# Altium schematic sheet analog_refs.SchDoc
size 699 x 359 mm; SheetNumber: 9; SheetTotal: 13
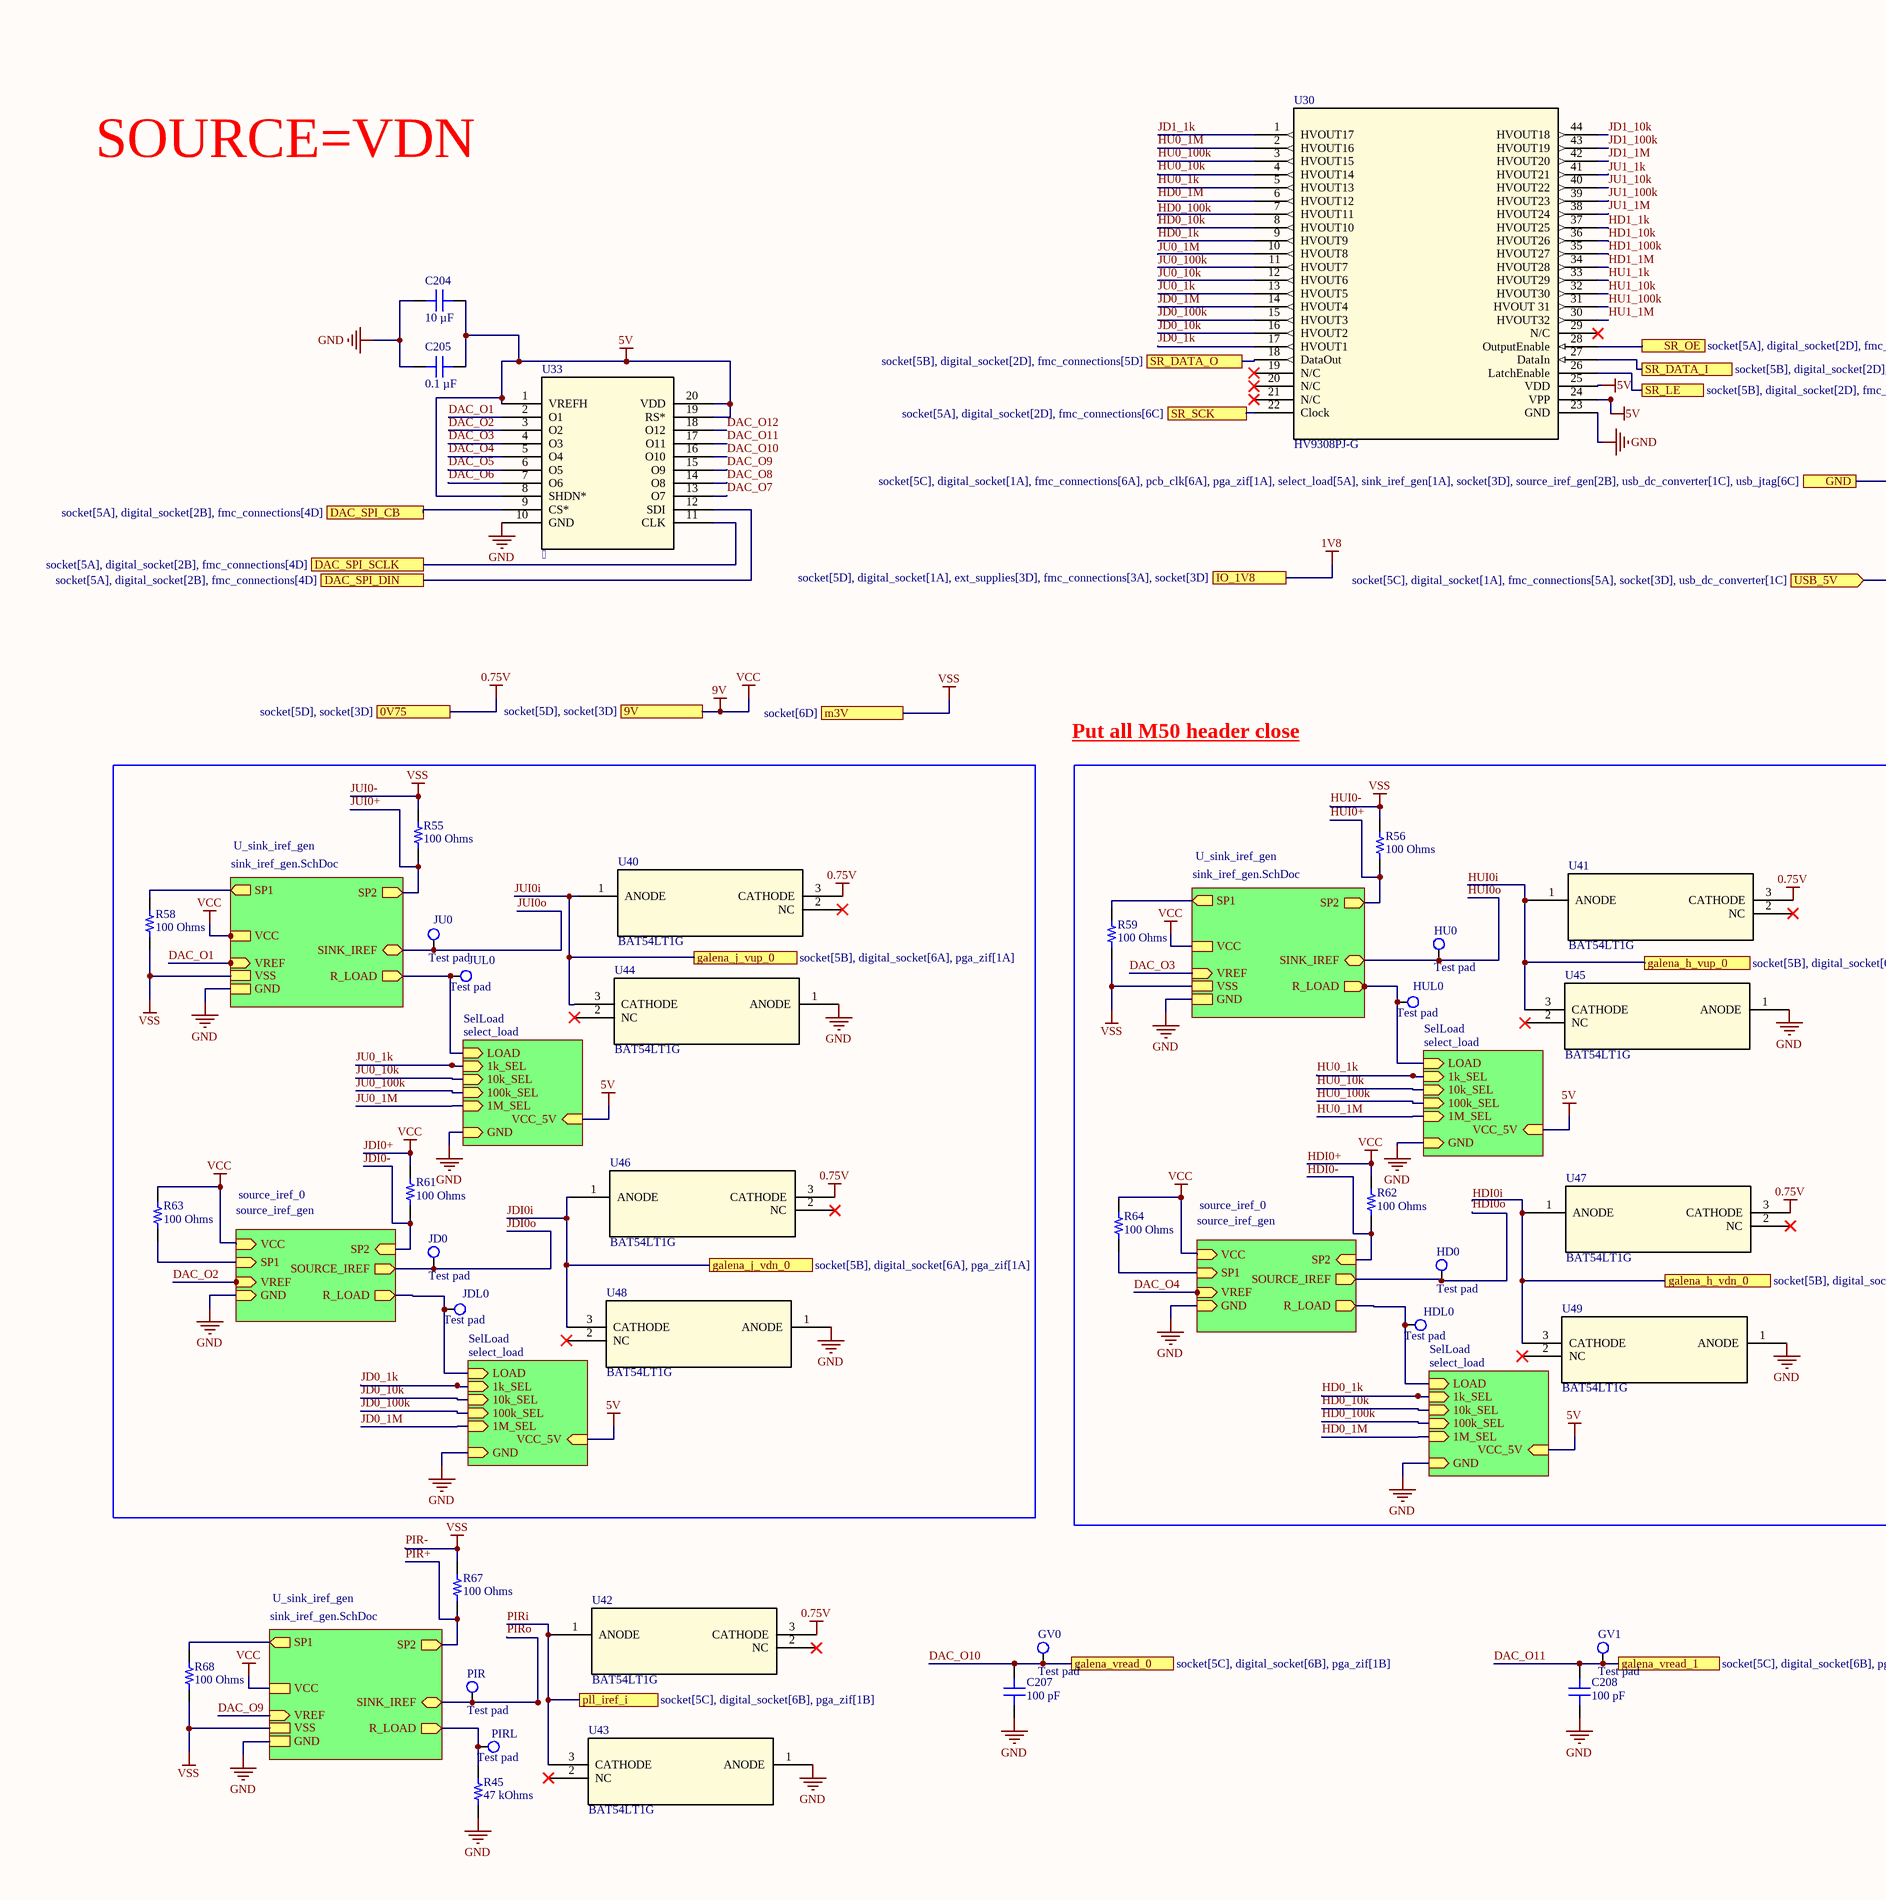
[diagram p0: analog_refs.SchDoc, left]
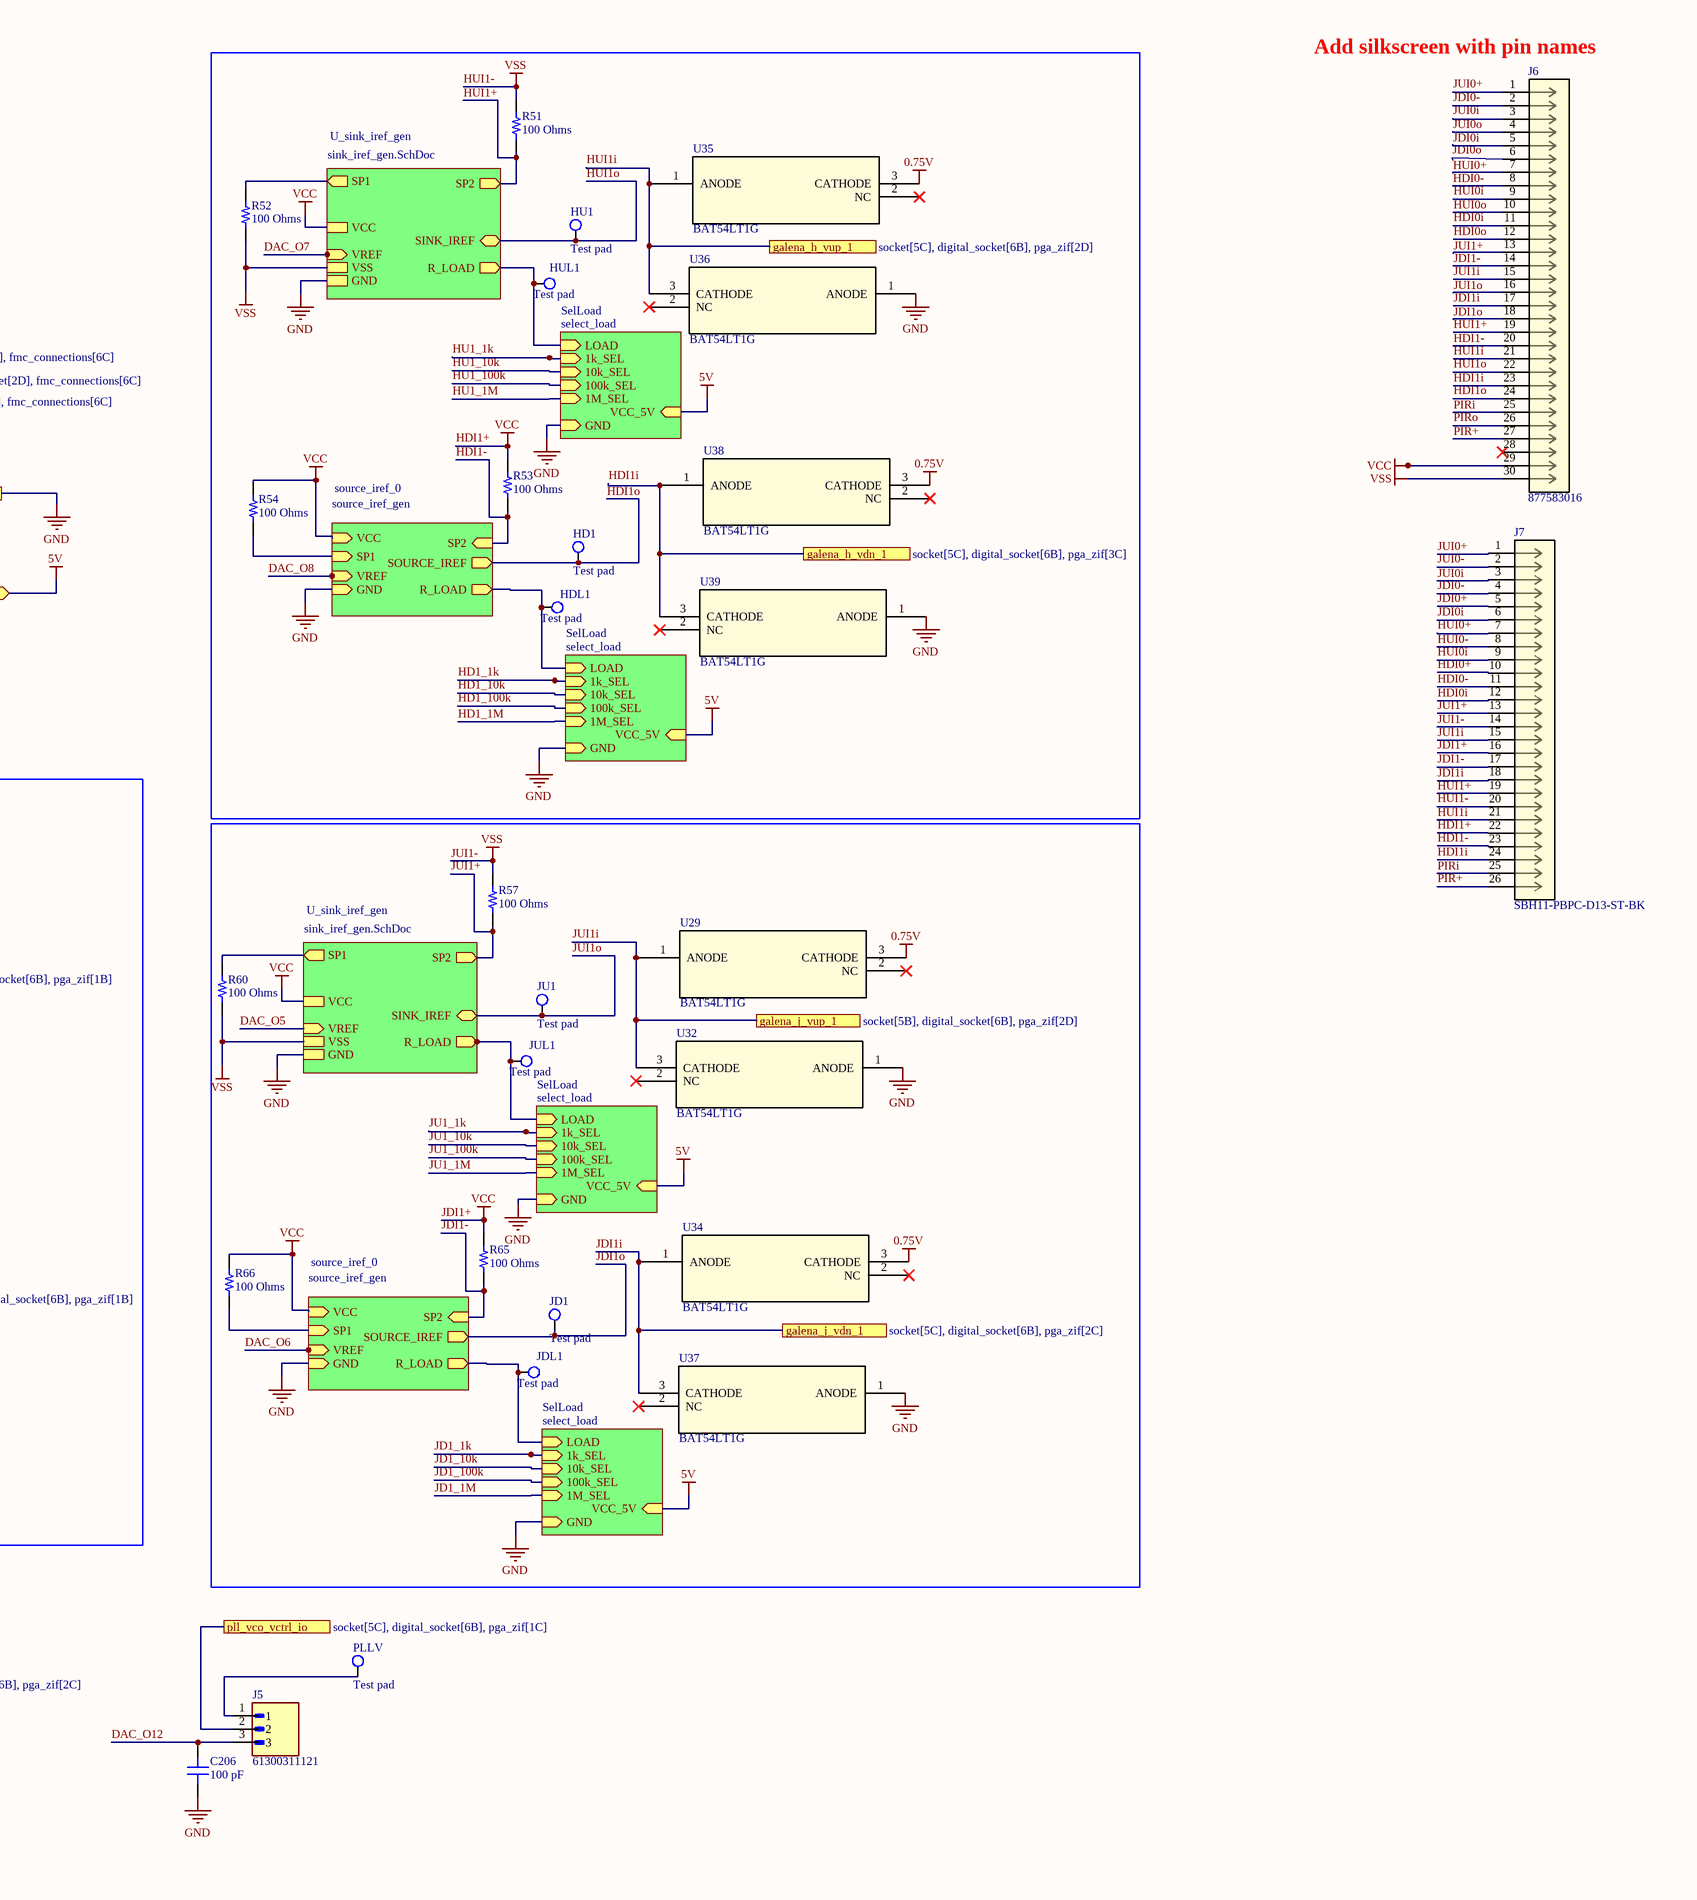
[diagram p1: analog_refs.SchDoc, right]

## Parts
C204  10 µF  [CAP 0805_2012]
C205  0.1 µF  [CAP 0805_2012]
C206  100 pF  [CAP 0805_2012]
C207  100 pF  [CAP 0805_2012]
C208  100 pF  [CAP 0805_2012]
GV0  Test pad  [Test Pad]
GV1  Test pad  [Test Pad]
HD0  Test pad  [Test Pad]
HD1  Test pad  [Test Pad]
HDL0  Test pad  [Test Pad]
HDL1  Test pad  [Test Pad]
HU0  Test pad  [Test Pad]
HU1  Test pad  [Test Pad]
HUL0  Test pad  [Test Pad]
HUL1  Test pad  [Test Pad]
J5  61300311121  [WURTH_61300311121]
J6  877583016  [CONN_SD-87758-107_30_MOL]
J7  SBH11-PBPC-D13-ST-BK  [CONN26_D13-ST-BK_SUL]
JD0  Test pad  [Test Pad]
JD1  Test pad  [Test Pad]
JDL0  Test pad  [Test Pad]
JDL1  Test pad  [Test Pad]
JU0  Test pad  [Test Pad]
JU1  Test pad  [Test Pad]
JUL0  Test pad  [Test Pad]
JUL1  Test pad  [Test Pad]
PIR  Test pad  [Test Pad]
PIRL  Test pad  [Test Pad]
PLLV  Test pad  [Test Pad]
R45  47 kOhms  [RES 0805_2012]
R51  100 Ohms  [RES 0805_2012]
R52  100 Ohms  [RES 0805_2012]
R53  100 Ohms  [RES 0805_2012]
R54  100 Ohms  [RES 0805_2012]
R55  100 Ohms  [RES 0805_2012]
R56  100 Ohms  [RES 0805_2012]
R57  100 Ohms  [RES 0805_2012]
R58  100 Ohms  [RES 0805_2012]
R59  100 Ohms  [RES 0805_2012]
R60  100 Ohms  [RES 0805_2012]
R61  100 Ohms  [RES 0805_2012]
R62  100 Ohms  [RES 0805_2012]
R63  100 Ohms  [RES 0805_2012]
R64  100 Ohms  [RES 0805_2012]
R65  100 Ohms  [RES 0805_2012]
R66  100 Ohms  [RES 0805_2012]
R67  100 Ohms  [RES 0805_2012]
R68  100 Ohms  [RES 0805_2012]
U29  BAT54LT1G  [SOT-23-3_1P4X3P040_ONS]
U30  HV9308PJ-G  [PLCC44_MC_MCH]
U32  BAT54LT1G  [SOT-23-3_1P4X3P040_ONS]
U33    [RU_20_ADI]
U34  BAT54LT1G  [SOT-23-3_1P4X3P040_ONS]
U35  BAT54LT1G  [SOT-23-3_1P4X3P040_ONS]
U36  BAT54LT1G  [SOT-23-3_1P4X3P040_ONS]
U37  BAT54LT1G  [SOT-23-3_1P4X3P040_ONS]
U38  BAT54LT1G  [SOT-23-3_1P4X3P040_ONS]
U39  BAT54LT1G  [SOT-23-3_1P4X3P040_ONS]
U40  BAT54LT1G  [SOT-23-3_1P4X3P040_ONS]
U41  BAT54LT1G  [SOT-23-3_1P4X3P040_ONS]
U42  BAT54LT1G  [SOT-23-3_1P4X3P040_ONS]
U43  BAT54LT1G  [SOT-23-3_1P4X3P040_ONS]
U44  BAT54LT1G  [SOT-23-3_1P4X3P040_ONS]
U45  BAT54LT1G  [SOT-23-3_1P4X3P040_ONS]
U46  BAT54LT1G  [SOT-23-3_1P4X3P040_ONS]
U47  BAT54LT1G  [SOT-23-3_1P4X3P040_ONS]
U48  BAT54LT1G  [SOT-23-3_1P4X3P040_ONS]
U49  BAT54LT1G  [SOT-23-3_1P4X3P040_ONS]

## Sub-sheets
SelLoad = select_load: LOAD (in), 1k_SEL (in), 10k_SEL (in), 100k_SEL (in), 1M_SEL (in), GND (in), VCC_5V (in)
SelLoad = select_load: LOAD (in), 1k_SEL (in), 10k_SEL (in), 100k_SEL (in), 1M_SEL (in), GND (in), VCC_5V (in)
SelLoad = select_load: LOAD (in), 1k_SEL (in), 10k_SEL (in), 100k_SEL (in), 1M_SEL (in), GND (in), VCC_5V (in)
SelLoad = select_load: LOAD (in), 1k_SEL (in), 10k_SEL (in), 100k_SEL (in), 1M_SEL (in), GND (in), VCC_5V (in)
SelLoad = select_load: LOAD (in), 1k_SEL (in), 10k_SEL (in), 100k_SEL (in), 1M_SEL (in), GND (in), VCC_5V (in)
SelLoad = select_load: LOAD (in), 1k_SEL (in), 10k_SEL (in), 100k_SEL (in), 1M_SEL (in), GND (in), VCC_5V (in)
SelLoad = select_load: LOAD (in), 1k_SEL (in), 10k_SEL (in), 100k_SEL (in), 1M_SEL (in), GND (in), VCC_5V (in)
SelLoad = select_load: LOAD (in), 1k_SEL (in), 10k_SEL (in), 100k_SEL (in), 1M_SEL (in), GND (in), VCC_5V (in)
source_iref_0 = source_iref_gen: R_LOAD (out), VREF (in), SOURCE_IREF (out), VCC (in), GND (in), SP1 (in), SP2 (in)
source_iref_0 = source_iref_gen: R_LOAD (out), VREF (in), SOURCE_IREF (out), VCC (in), GND (in), SP1 (in), SP2 (in)
source_iref_0 = source_iref_gen: R_LOAD (out), VREF (in), SOURCE_IREF (out), VCC (in), GND (in), SP1 (in), SP2 (in)
source_iref_0 = source_iref_gen: R_LOAD (out), VREF (in), SOURCE_IREF (out), VCC (in), GND (in), SP1 (in), SP2 (in)
U_sink_iref_gen = sink_iref_gen.SchDoc: SINK_IREF (bidir), R_LOAD (out), VREF (in), GND, VCC, VSS, SP2 (out), SP1 (out)
U_sink_iref_gen = sink_iref_gen.SchDoc: SINK_IREF (bidir), R_LOAD (out), VREF (in), GND, VCC, VSS, SP2 (out), SP1 (out)
U_sink_iref_gen = sink_iref_gen.SchDoc: SINK_IREF (bidir), R_LOAD (out), VREF (in), GND, VCC, VSS, SP2 (out), SP1 (out)
U_sink_iref_gen = sink_iref_gen.SchDoc: SINK_IREF (bidir), R_LOAD (out), VREF (in), GND, VCC, VSS, SP2 (out), SP1 (out)
U_sink_iref_gen = sink_iref_gen.SchDoc: SINK_IREF (bidir), R_LOAD (out), VREF (in), GND, VCC, VSS, SP2 (out), SP1 (out)

## Ports
0V75 (see socket[5D], socket[3D]), 9V (see socket[5D], socket[3D]), DAC_SPI_CB (see socket[5A], digital_socket[2B], fmc_connections[4D]), DAC_SPI_DIN (see socket[5A], digital_socket[2B], fmc_connections[4D]), DAC_SPI_SCLK (see socket[5A], digital_socket[2B], fmc_connections[4D]), galena_h_vdn_0 (see socket[5B], digital_socket[6B], pga_zif[1B]), galena_h_vdn_1 (see socket[5C], digital_socket[6B], pga_zif[3C]), galena_h_vup_0 (see socket[5B], digital_socket[6B], pga_zif[1B]), galena_h_vup_1 (see socket[5C], digital_socket[6B], pga_zif[2D]), galena_j_vdn_0 (see socket[5B], digital_socket[6A], pga_zif[1A]), galena_j_vdn_1 (see socket[5C], digital_socket[6B], pga_zif[2C]), galena_j_vup_0 (see socket[5B], digital_socket[6A], pga_zif[1A]), galena_j_vup_1 (see socket[5B], digital_socket[6B], pga_zif[2D]), galena_vread_0 (see socket[5C], digital_socket[6B], pga_zif[1B]), galena_vread_1 (see socket[5C], digital_socket[6B], pga_zif[2C]), GND (see socket[5C], digital_socket[1A], fmc_connections[6A], pcb_clk[6A], pga_zif[1A], select_load[5A], sink_iref_gen[1A], socket[3D], source_iref_gen[2B], usb_dc_converter[1C], usb_jtag[6C]), IO_1V8 (see socket[5D], digital_socket[1A], ext_supplies[3D], fmc_connections[3A], socket[3D]), m3V (see socket[6D]), pll_iref_i (see socket[5C], digital_socket[6B], pga_zif[1B]), pll_vco_vctrl_io (see socket[5C], digital_socket[6B], pga_zif[1C]), SR_DATA_I (see socket[5B], digital_socket[2D], fmc_connections[6C]), SR_DATA_O (see socket[5B], digital_socket[2D], fmc_connections[5D]), SR_LE (see socket[5B], digital_socket[2D], fmc_connections[6C]), SR_OE (see socket[5A], digital_socket[2D], fmc_connections[6C]), SR_SCK (see socket[5A], digital_socket[2D], fmc_connections[6C]), USB_5V (in, see socket[5C], digital_socket[1A], fmc_connections[5A], socket[3D], usb_dc_converter[1C])

## Nets
0.75V: U29.3(CATHODE) U34.3(CATHODE) U35.3(CATHODE) U38.3(CATHODE) U40.3(CATHODE) U41.3(CATHODE) U42.3(CATHODE) U46.3(CATHODE) U47.3(CATHODE) ; port 0V75
1V8: port IO_1V8
5V: C204.2 C205.2 U30.24(VPP) U30.25(VDD) U33.1(VREFH) U33.8(SHDN*) U33.19(RS*) U33.20(VDD) ; port USB_5V, sheet SelLoad/VCC_5V, sheet SelLoad/VCC_5V, sheet SelLoad/VCC_5V, sheet SelLoad/VCC_5V, sheet SelLoad/VCC_5V, sheet SelLoad/VCC_5V, sheet SelLoad/VCC_5V, sheet SelLoad/VCC_5V
GND: C204.1 C205.1 C206.1 C207.1 C208.1 R45.1 U30.23(GND) U32.1(ANODE) U33.10(GND) U36.1(ANODE) U37.1(ANODE) U39.1(ANODE) U43.1(ANODE) U44.1(ANODE) U45.1(ANODE) U48.1(ANODE) U49.1(ANODE) ; port GND, sheet SelLoad/GND, sheet source_iref_0/GND, sheet SelLoad/GND, sheet SelLoad/GND, sheet SelLoad/GND, sheet SelLoad/GND, sheet SelLoad/GND, sheet SelLoad/GND, sheet SelLoad/GND, sheet source_iref_0/GND, sheet source_iref_0/GND, sheet source_iref_0/GND, sheet U_sink_iref_gen/GND, sheet U_sink_iref_gen/GND, sheet U_sink_iref_gen/GND, sheet U_sink_iref_gen/GND, sheet U_sink_iref_gen/GND
HDI0+: J6.29 J7.5 J7.10 J7.16 J7.22 R53.2 R54.2 R61.2 R62.2 R63.2 R64.2 R65.2 R66.2 ; port 9V, sheet source_iref_0/VCC, sheet source_iref_0/VCC, sheet source_iref_0/VCC, sheet source_iref_0/VCC, sheet U_sink_iref_gen/VCC, sheet U_sink_iref_gen/VCC, sheet U_sink_iref_gen/VCC, sheet U_sink_iref_gen/VCC, sheet U_sink_iref_gen/VCC  [also labelled 9V, HDI1+, JDI0+, JDI1+, VCC]
HUI0-: J6.30 J7.2 J7.8 J7.14 J7.20 R51.2 R52.1 R55.2 R56.2 R57.2 R58.1 R59.1 R60.1 R67.2 R68.1 ; port m3V, sheet U_sink_iref_gen/VSS, sheet U_sink_iref_gen/VSS, sheet U_sink_iref_gen/VSS, sheet U_sink_iref_gen/VSS, sheet U_sink_iref_gen/VSS  [also labelled HUI1-, JUI0-, JUI1-, PIR-, VSS]
DAC_O1: U33.2(O1) ; sheet U_sink_iref_gen/VREF
DAC_O2: U33.3(O2) ; sheet source_iref_0/VREF
DAC_O3: U33.4(O3) ; sheet U_sink_iref_gen/VREF
DAC_O4: U33.5(O4) ; sheet source_iref_0/VREF
DAC_O5: U33.6(O5) ; sheet U_sink_iref_gen/VREF
DAC_O6: U33.7(O6) ; sheet source_iref_0/VREF
DAC_O7: U33.13(O7) ; sheet U_sink_iref_gen/VREF
DAC_O8: U33.14(O8) ; sheet source_iref_0/VREF
DAC_O9: U33.15(O9) ; sheet U_sink_iref_gen/VREF
DAC_O10: C207.2 GV0.1 U33.16(O10) ; port galena_vread_0
DAC_O11: C208.2 GV1.1 U33.17(O11) ; port galena_vread_1
DAC_O12: C206.2 J5.3 U33.18(O12)
DAC_SPI_CB: U33.9(CS*) ; port DAC_SPI_CB
DAC_SPI_DIN: U33.12(SDI) ; port DAC_SPI_DIN
DAC_SPI_SCLK: U33.11(CLK) ; port DAC_SPI_SCLK
HD0_1k: U30.9(HVOUT9) ; sheet SelLoad/1k_SEL
HD0_1M: U30.6(HVOUT12) ; sheet SelLoad/1M_SEL
HD0_10k: U30.8(HVOUT10) ; sheet SelLoad/10k_SEL
HD0_100k: U30.7(HVOUT11) ; sheet SelLoad/100k_SEL
HD1_1k: U30.37(HVOUT25) ; sheet SelLoad/1k_SEL
HD1_1M: U30.34(HVOUT28) ; sheet SelLoad/1M_SEL
HD1_10k: U30.36(HVOUT26) ; sheet SelLoad/10k_SEL
HD1_100k: U30.35(HVOUT27) ; sheet SelLoad/100k_SEL
HDI0-: J6.8 J7.11 R62.1 ; sheet source_iref_0/SP2
HDI0i: J6.11 J7.12 U47.1(ANODE) U49.3(CATHODE) ; port galena_h_vdn_0
HDI0o: HD0.1 J6.12 ; sheet source_iref_0/SOURCE_IREF
HDI1-: J6.20 J7.23 R53.1 ; sheet source_iref_0/SP2
HDI1i: J6.23 J7.24 U38.1(ANODE) U39.3(CATHODE) ; port galena_h_vdn_1
HDI1o: HD1.1 J6.24 ; sheet source_iref_0/SOURCE_IREF
HU0_1k: U30.5(HVOUT13) ; sheet SelLoad/1k_SEL
HU0_1M: U30.2(HVOUT16) ; sheet SelLoad/1M_SEL
HU0_10k: U30.4(HVOUT14) ; sheet SelLoad/10k_SEL
HU0_100k: U30.3(HVOUT15) ; sheet SelLoad/100k_SEL
HU1_1k: U30.33(HVOUT29) ; sheet SelLoad/1k_SEL
HU1_1M: U30.30(HVOUT32) ; sheet SelLoad/1M_SEL
HU1_10k: U30.32(HVOUT30) ; sheet SelLoad/10k_SEL
HU1_100k: U30.31(HVOUT_31) ; sheet SelLoad/100k_SEL
HUI0+: J6.7 J7.7 R56.1 ; sheet U_sink_iref_gen/SP2
HUI0i: J6.9 J7.9 U41.1(ANODE) U45.3(CATHODE) ; port galena_h_vup_0
HUI0o: HU0.1 J6.10 ; sheet U_sink_iref_gen/SINK_IREF
HUI1+: J6.19 J7.19 R51.1 ; sheet U_sink_iref_gen/SP2
HUI1i: J6.21 J7.21 U35.1(ANODE) U36.3(CATHODE) ; port galena_h_vup_1
HUI1o: HU1.1 J6.22 ; sheet U_sink_iref_gen/SINK_IREF
JD0_1k: U30.17(HVOUT1) ; sheet SelLoad/1k_SEL
JD0_1M: U30.14(HVOUT4) ; sheet SelLoad/1M_SEL
JD0_10k: U30.16(HVOUT2) ; sheet SelLoad/10k_SEL
JD0_100k: U30.15(HVOUT3) ; sheet SelLoad/100k_SEL
JD1_1k: U30.1(HVOUT17) ; sheet SelLoad/1k_SEL
JD1_1M: U30.42(HVOUT20) ; sheet SelLoad/1M_SEL
JD1_10k: U30.44(HVOUT18) ; sheet SelLoad/10k_SEL
JD1_100k: U30.43(HVOUT19) ; sheet SelLoad/100k_SEL
JDI0-: J6.2 J7.4 R61.1 ; sheet source_iref_0/SP2
JDI0i: J6.5 J7.6 U46.1(ANODE) U48.3(CATHODE) ; port galena_j_vdn_0
JDI0o: J6.6 JD0.1 ; sheet source_iref_0/SOURCE_IREF
JDI1-: J6.14 J7.17 R65.1 ; sheet source_iref_0/SP2
JDI1i: J6.17 J7.18 U34.1(ANODE) U37.3(CATHODE) ; port galena_j_vdn_1
JDI1o: J6.18 JD1.1 ; sheet source_iref_0/SOURCE_IREF
JU0_1k: U30.13(HVOUT5) ; sheet SelLoad/1k_SEL
JU0_1M: U30.10(HVOUT8) ; sheet SelLoad/1M_SEL
JU0_10k: U30.12(HVOUT6) ; sheet SelLoad/10k_SEL
JU0_100k: U30.11(HVOUT7) ; sheet SelLoad/100k_SEL
JU1_1k: U30.41(HVOUT21) ; sheet SelLoad/1k_SEL
JU1_1M: U30.38(HVOUT24) ; sheet SelLoad/1M_SEL
JU1_10k: U30.40(HVOUT22) ; sheet SelLoad/10k_SEL
JU1_100k: U30.39(HVOUT23) ; sheet SelLoad/100k_SEL
JUI0+: J6.1 J7.1 R55.1 ; sheet U_sink_iref_gen/SP2
JUI0i: J6.3 J7.3 U40.1(ANODE) U44.3(CATHODE) ; port galena_j_vup_0
JUI0o: J6.4 JU0.1 ; sheet U_sink_iref_gen/SINK_IREF
JUI1+: J6.13 J7.13 R57.1 ; sheet U_sink_iref_gen/SP2
JUI1i: J6.15 J7.15 U29.1(ANODE) U32.3(CATHODE) ; port galena_j_vup_1
JUI1o: J6.16 JU1.1 ; sheet U_sink_iref_gen/SINK_IREF
PIR+: J6.27 J7.26 R67.1 ; sheet U_sink_iref_gen/SP2
PIRi: J6.25 J7.25 U42.1(ANODE) U43.3(CATHODE) ; port pll_iref_i
PIRo: J6.26 PIR.1 ; sheet U_sink_iref_gen/SINK_IREF
pll_vco_vctrl_io: J5.2 ; port pll_vco_vctrl_io
SR_DATA_I: U30.27(DataIn) ; port SR_DATA_I
SR_DATA_O: U30.18(DataOut) ; port SR_DATA_O
SR_LE: U30.26(LatchEnable) ; port SR_LE
SR_OE: U30.28(OutputEnable) ; port SR_OE
SR_SCK: U30.22(Clock) ; port SR_SCK
NetHDL0_1: HDL0.1 ; sheet SelLoad/LOAD, sheet source_iref_0/R_LOAD
NetHDL1_1: HDL1.1 ; sheet SelLoad/LOAD, sheet source_iref_0/R_LOAD
NetHUL0_1: HUL0.1 ; sheet SelLoad/LOAD, sheet U_sink_iref_gen/R_LOAD
NetHUL1_1: HUL1.1 ; sheet SelLoad/LOAD, sheet U_sink_iref_gen/R_LOAD
NetJ5_1: J5.1 PLLV.1
NetJDL0_1: JDL0.1 ; sheet source_iref_0/R_LOAD, sheet SelLoad/LOAD
NetJDL1_1: JDL1.1 ; sheet SelLoad/LOAD, sheet source_iref_0/R_LOAD
NetJUL0_1: JUL0.1 ; sheet SelLoad/LOAD
NetJUL1_1: JUL1.1 ; sheet SelLoad/LOAD, sheet U_sink_iref_gen/R_LOAD
NetPIRL_1: PIRL.1 R45.2 ; sheet U_sink_iref_gen/R_LOAD
NetR52_2: R52.2 ; sheet U_sink_iref_gen/SP1
NetR54_1: R54.1 ; sheet source_iref_0/SP1
NetR58_2: R58.2 ; sheet U_sink_iref_gen/SP1
NetR59_2: R59.2 ; sheet U_sink_iref_gen/SP1
NetR60_2: R60.2 ; sheet U_sink_iref_gen/SP1
NetR63_1: R63.1 ; sheet source_iref_0/SP1
NetR64_1: R64.1 ; sheet source_iref_0/SP1
NetR66_1: R66.1 ; sheet source_iref_0/SP1
NetR68_2: R68.2 ; sheet U_sink_iref_gen/SP1

Not connected (* = marked no-connect by the designer): J6 28*; U29 2(NC)*; U30 19(N/C)* 20(N/C)* 21(N/C)* 29(N/C)*; U32 2(NC)*; U34 2(NC)*; U35 2(NC)*; U36 2(NC)*; U37 2(NC)*; U38 2(NC)*; U39 2(NC)*; U40 2(NC)*; U41 2(NC)*; U42 2(NC)*; U43 2(NC)*; U44 2(NC)*; U45 2(NC)*; U46 2(NC)*; U47 2(NC)*; U48 2(NC)*; U49 2(NC)*

## Notes on the sheet
- (near J6) Add silkscreen with pin names
- SOURCE=VDN
- Put all M50 header close

## Library data of the parts
C204 = 0805BW106K160NGT: CAP CER 10UF 16V X5R 0805; manufacturer: Knowles Novacap; Tolerance: ±10%; Part Number: 0805BW106K160NGT; Capacitance: 10 µF; Applications: SMPS Filtering; componentlink1description: Datasheet; componentlink1url: https://www.knowlescapacitors.com/getattachment/6c8d48ef-fc2b-4752-ae2c-ce6c208de0c4/High-Capacitance-Chip.aspx; componentlink2description: DigiKey Link; componentlink2url: https://www.digikey.com/en/products/detail/knowles-novacap/0805BW106K160NGT/7303991; Device Package: 0805 (2012 Metric); Features: Bonding Mountable, Gold Flash Termination; lastupdated: 4/6/2026 7:32:52 PM; Lifecycle Status: Active; Minimum Order: 1; Mounting Type: Surface Mount, MLCC, Epoxy; Operating Temperature: -55°C ~ 85°C; Package / Case: 0805 (2012 Metric); packaging: TapeAndReel; partid: 10571; Part Status: Active; price: 1.74; series: -; Size / Dimension: 0.080" L x 0.050" W (2.03mm x 1.27mm); Supplier 1: DigiKey; Supplier Part Number 1: 1763-1170-1-ND; Temperature Coefficient: X5R; Thickness (Max): 0.054" (1.37mm); value: 10 µF; Voltage - Rated: 16V
C205 = CC0805MRX7R9BB104: CAP CER 0.1UF 50V X7R 0805; manufacturer: Yageo; Tolerance: ±20%; Part Number: CC0805MRX7R9BB104; Capacitance: 0.1 µF; Applications: General Purpose; componentlink1description: Datasheet; componentlink1url: https://www.yageo.com/upload/media/product/productsearch/datasheet/mlcc/UPY-GPHC_X7R_6.3V-to-50V_18.pdf; componentlink2description: DigiKey Link; componentlink2url: https://www.digikey.com/en/products/detail/yageo/CC0805MRX7R9BB104/5884281; Device Package: 0805 (2012 Metric); lastupdated: 4/6/2026 7:33:19 PM; Lifecycle Status: Active; Minimum Order: 1; Mounting Type: Surface Mount, MLCC; Operating Temperature: -55°C ~ 125°C; Package / Case: 0805 (2012 Metric); packaging: TapeAndReel; partid: 2475; Part Status: Active; price: 0.01; series: CC; Size / Dimension: 0.079" L x 0.049" W (2.00mm x 1.25mm); Supplier 1: DigiKey; Supplier Part Number 1: 311-4351-1-ND; Temperature Coefficient: X7R; Thickness (Max): 0.037" (0.95mm); value: 0.1 µF; Voltage - Rated: 50V
C206-C208 = 500R15N101JV4T: CAP CER 100PF 50V C0G/NP0 0805; manufacturer: Johanson Dielectrics Inc.; Temperature Coefficient: C0G, NP0; Tolerance: ±5%; Part Number: 500R15N101JV4T; Capacitance: 100 pF; Applications: General Purpose; componentlink1description: Datasheet; componentlink1url: https://www.johansondielectrics.com/downloads/catalog/johanson-dielectrics-product-catalog.pdf; componentlink2description: DigiKey Link; componentlink2url: https://www.digikey.com/en/products/detail/johanson-dielectrics-inc/500R15N101JV4T/1859421; Device Package: 0805 (2012 Metric); lastupdated: 4/6/2026 7:32:47 PM; Lifecycle Status: Active; Minimum Order: 1; Mounting Type: Surface Mount, MLCC; Operating Temperature: -55°C ~ 125°C; Package / Case: 0805 (2012 Metric); packaging: TapeAndReel; partid: 11835; Part Status: Active; price: 0.02; series: -; Size / Dimension: 0.080" L x 0.050" W (2.03mm x 1.27mm); Supplier 1: DigiKey; Supplier Part Number 1: 709-1176-1-ND; Thickness (Max): 0.050" (1.27mm); value: 100 pF; Voltage - Rated: 50V
J6 = 877583016: 2.00mm Pitch Milli-Grid Header, Through Hole, Vertical, 30 Circuits, 0.38Âµm Gold (Au) Selective Plating, Pocket Tray Packaging, Lead-Free; Manufacturer_Name: Molex Connector Corporation; Copyright: Copyright (C) 2025 Ultra Librarian. All rights reserved.; Manufacturer_Part_Number: 877583016; RefDes: RefDes; Type: Type
J7 = SBH11-PBPC-D13-ST-BK: Description; Manufacturer_Name: Sullins; Copyright: Copyright (C) 2025 Ultra Librarian. All rights reserved.; Manufacturer_Part_Number: SBH11-PBPC-D13-ST-BK; RefDes: RefDes; Type: Type
R45 = CRGP0805F47K: RES 47K OHM 1% 1/3W 0805; Manufacturer: TE Connectivity Passive Product; Power (Watts): 0.333W, 1/3W; Temperature Coefficient: ±100ppm/°C; Part Number: CRGP0805F47K; Value: 47 kOhms; ComponentLink1Description: Datasheet; ComponentLink1URL: https://www.te.com/commerce/DocumentDelivery/DDEController?Action=srchrtrv&DocNm=9-1773463-9&DocType=DS&DocLang=English; ComponentLink2Description: DigiKey Link; ComponentLink2URL: https://www.digikey.com/en/products/detail/te-connectivity-passive-product/CRGP0805F47K/8577099; Composition: Thick Film; Device Package: 0805 (2012 Metric); Features: Automotive AEC-Q200, Pulse Withstanding; Height - Seated (Max): 0.026" (0.65mm); LastUpdated: 4/5/2026 8:11:22 PM; Lifecycle Status: Active; Minimum Order: 1; Number of Terminations: 2; Operating Temperature: -55°C ~ 155°C; Package / Case: 0805 (2012 Metric); Packaging: TapeAndReel; PartId: 28741; Part Status: Active; Price: 0.03; Resistance: 47 kOhms; Series: CRGP; Size / Dimension: 0.079" L x 0.049" W (2.00mm x 1.25mm); Supplier 1: DigiKey; Supplier Part Number 1: A130497CT-ND; Supplier Device Package: 0805; Tolerance: ±1%
R51-R68 = 2-2176091-4: RES SMD 100 OHM 0.1% 1/4W 0805; Manufacturer: TE Connectivity Passive Product; Power (Watts): 0.25W, 1/4W; Temperature Coefficient: ±25ppm/°C; Part Number: 2-2176091-4; Value: 100 Ohms; ComponentLink1Description: Datasheet; ComponentLink1URL: https://www.te.com/commerce/DocumentDelivery/DDEController?Action=srchrtrv&DocNm=1773272&DocType=DS&DocLang=English; ComponentLink2Description: DigiKey Link; ComponentLink2URL: https://www.digikey.com/en/products/detail/te-connectivity-passive-product/2-2176091-4/4033915; Composition: Thin Film; Device Package: 0805 (2012 Metric); Height - Seated (Max): 0.026" (0.65mm); LastUpdated: 4/5/2026 8:11:23 PM; Lifecycle Status: Active; Minimum Order: 1; Number of Terminations: 2; Operating Temperature: -55°C ~ 155°C; Package / Case: 0805 (2012 Metric); Packaging: TapeAndReel; PartId: 28489; Part Status: Active; Price: 0.13; Resistance: 100 Ohms; Series: RP73P, Holsworthy; Size / Dimension: 0.079" L x 0.049" W (2.00mm x 1.25mm); Supplier 1: DigiKey; Supplier Part Number 1: A110447CT-ND; Supplier Device Package: 0805; Tolerance: ±0.1%
U29 U32 U34-U49 = BAT54LT1G: Description; Manufacturer_Name: onsemi; Copyright: Copyright (C) 2025 Ultra Librarian. All rights reserved.; Manufacturer_Part_Number: BAT54LT1G; RefDes: RefDes; Type: Type
U30 = HV9308PJ-G: No Description Available; Manufacturer_Name: Microchip; Copyright: Copyright (C) 2026 Ultra Librarian. All rights reserved.; Manufacturer_Part_Number: HV9308PJ-G; RefDes: RefDes; Type: Type
U33 = AD8802ARUZ-REEL: 12 Channel, 8-Bit TrimDACs with Power Shutdown & Mid-Scale Preset; Manufacturer_Name: Analog Devices Inc; Copyright: Copyright (C) 2026 Ultra Librarian. All rights reserved.; Manufacturer_Part_Number: AD8802ARUZ-REEL; Datasheet: https://www.analog.com/media/en/technical-documentation/data-sheets/AD8802_8804.pdf; RefDes: RefDes; Type: Type
J5 = 61300311121: Package: None; Price: None; Value: *; MP: 61300311121; Availability: Unavailable